# EAGLE design otto (EAGLE 9.6.2)
AUTHOR: w. boyett; CONTACT_COMPANY: github.com/watsonboyett; LICENSE: CC-BY-SA; REV: 2A
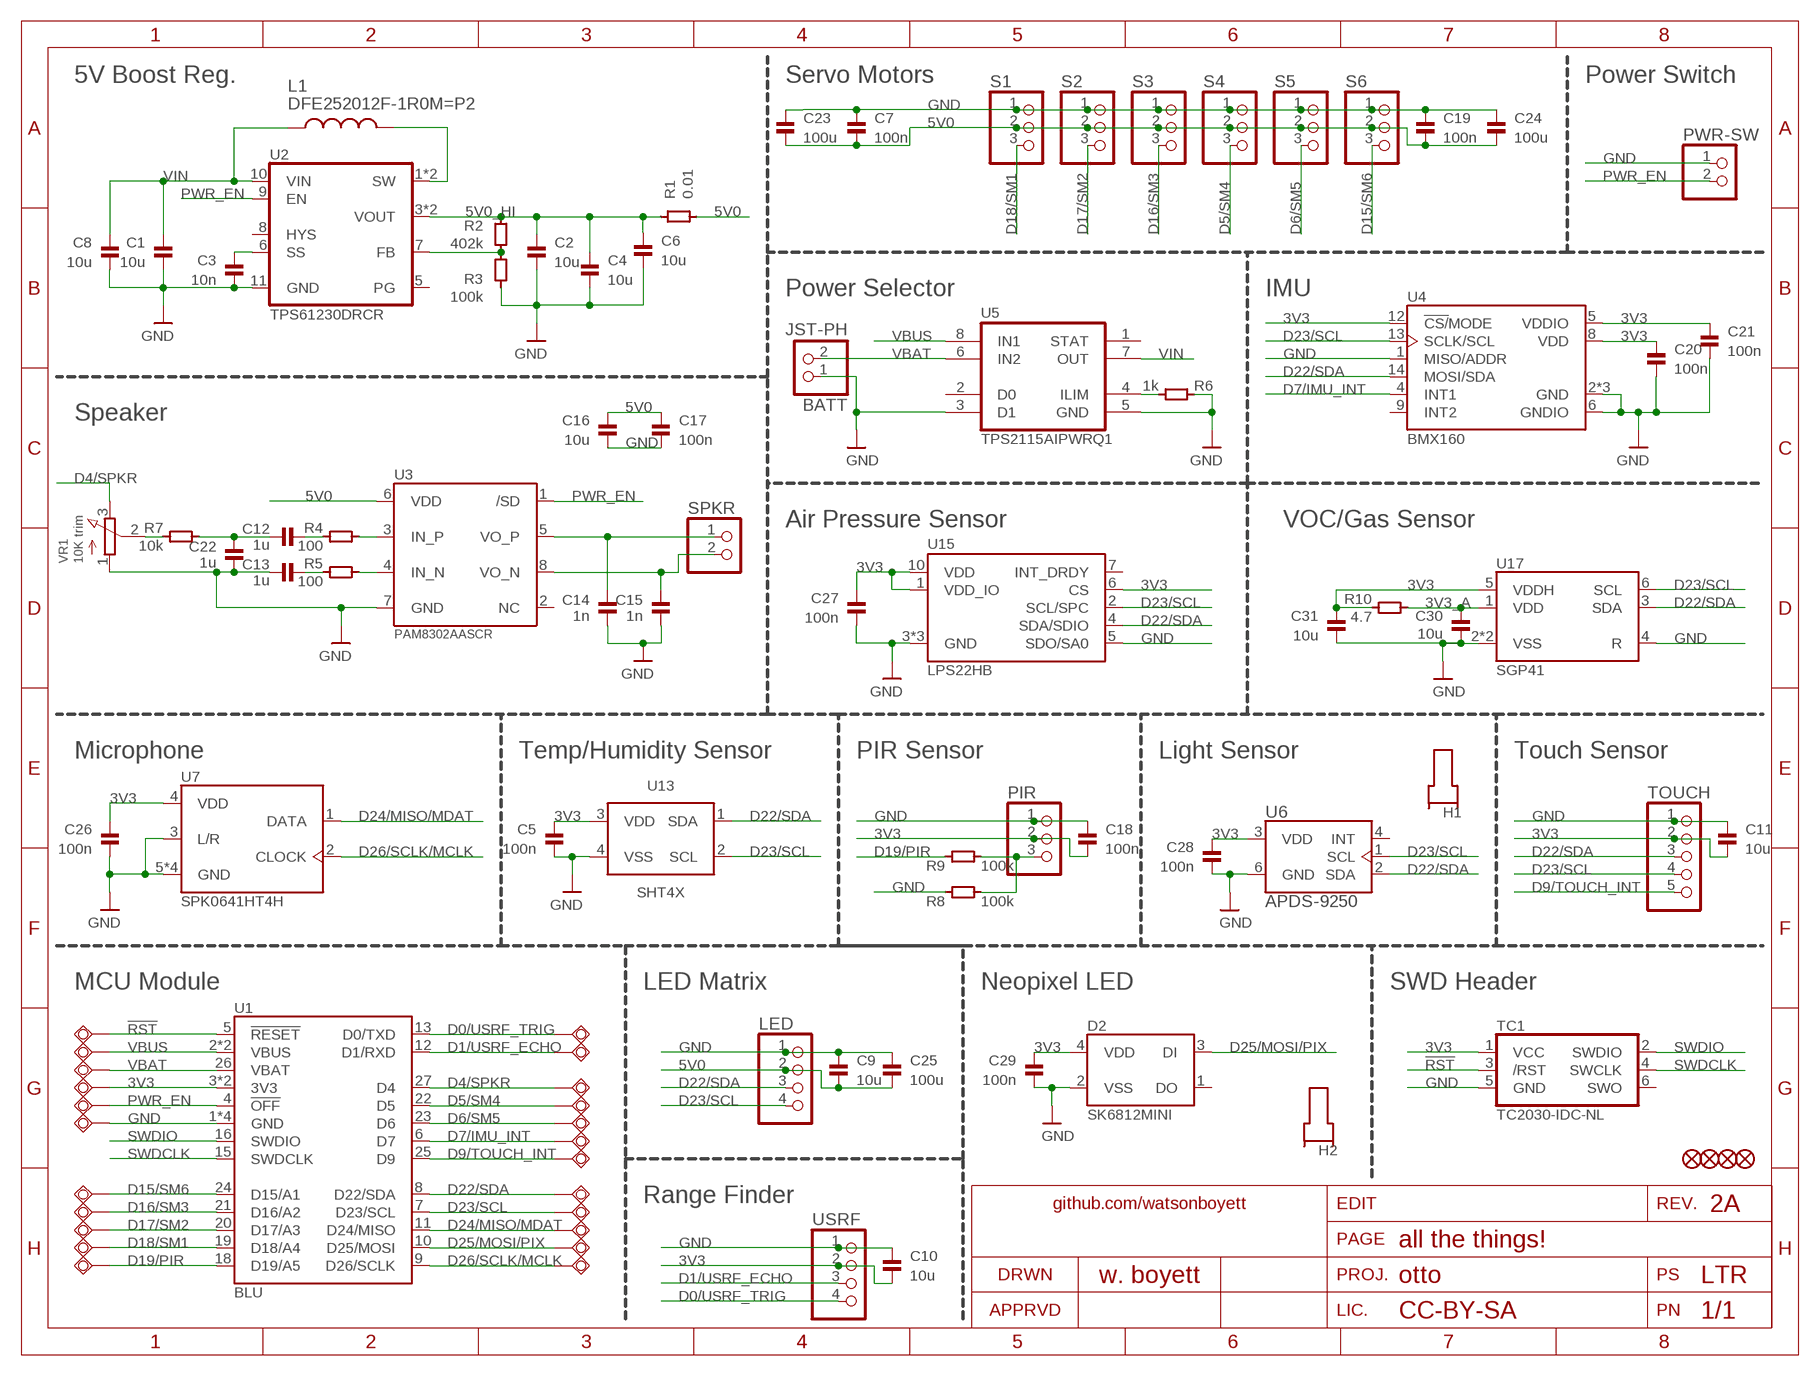
[diagram p0: schematic, sheet 1]
FRAME1 (LETTER_L): SECTION: all the things!

## Parts
3V3  TPSQTP10R  [TP10R]
BATT  JST-PH  CON_JST_PH_2PIN-S2B  [JSTPH2-S2B]
C1  10u  CAP_CERAMIC_0603  [_0603]
C2  10u  CAP_CERAMIC_0603  [_0603]
C3  10n  CAP_CERAMIC_0603  [_0603]
C4  10u  CAP_CERAMIC_0603  [_0603]
C5  100n  CAP_CERAMIC_0603  [_0603]
C6  10u  CAP_CERAMIC_0603  [_0603]
C7  100n  CAP_CERAMIC_0603  [_0603]
C8  10u  CAP_CERAMIC_0603  [_0603]
C9  10u  CAP_CERAMIC_0603  [_0603]
C10  10u  CAP_CERAMIC_0603  [_0603]
C11  10u  CAP_CERAMIC_0603  [_0603]
C12  1u  CAP_CERAMIC_0603  [_0603]
C13  1u  CAP_CERAMIC_0603  [_0603]
C14  1n  CAP_CERAMIC_0603  [_0603]
C15  1n  CAP_CERAMIC_0603  [_0603]
C16  10u  CAP_CERAMIC_0603  [_0603]
C17  100n  CAP_CERAMIC_0603  [_0603]
C18  100n  CAP_CERAMIC_0603  [_0603]
C19  100n  CAP_CERAMIC_0603  [_0603]
C20  100n  CAP_CERAMIC_0603  [_0603]
C21  100n  CAP_CERAMIC_0603  [_0603]
C22  1u  CAP_CERAMIC_0603  [_0603]
C23  100u  CAP_CERAMIC_1206  [_1206]
C24  100u  CAP_CERAMIC_1206  [_1206]
C25  100u  CAP_CERAMIC_1206  [_1206]
C26  100n  CAP_CERAMIC_0603  [_0603]
C27  100n  CAP_CERAMIC_0603  [_0603]
C28  100n  CAP_CERAMIC_0603  [_0603]
C29  100n  CAP_CERAMIC_0603  [_0603]
C30  10u  CAP_CERAMIC_0603  [_0603]
C31  10u  CAP_CERAMIC_0603  [_0603]
D0  TPSQTP10R  [TP10R]
D1  TPSQTP10R  [TP10R]
D2  SK6812MINI  [SK6812MINI]
D4  TPSQTP10R  [TP10R]
D5  TPSQTP10R  [TP10R]
D6  TPSQTP10R  [TP10R]
D7  TPSQTP10R  [TP10R]
D9  TPSQTP10R  [TP10R]
D15  TPSQTP10R  [TP10R]
D16  TPSQTP10R  [TP10R]
D17  TPSQTP10R  [TP10R]
D18  TPSQTP10R  [TP10R]
D19  TPSQTP10R  [TP10R]
D24  TPSQTP10R  [TP10R]
D25  TPSQTP10R  [TP10R]
D26  TPSQTP10R  [TP10R]
FID1  FIDUCIAL0.8MM  [FIDUCIAL_0.8MM]
FID2  FIDUCIAL0.8MM  [FIDUCIAL_0.8MM]
FID3  FIDUCIAL0.8MM  [FIDUCIAL_0.8MM]
FID5  FIDUCIAL0.8MM  [FIDUCIAL_0.8MM]
GND  TPSQTP10R  [TP10R]
H1  VLP-XXX-X  [VLP-XXX-X]
H2  VLP-XXX-X  [VLP-XXX-X]
L1  DFE252012F-1R0M=P2  [INDC2520X120N]
LED  PINHD-1X4  [1X04]
PEN  TPSQTP10R  [TP10R]
PIR  PINHD-1X3  [1X03]
PWR-SW  PINHD-1X2  [1X02]
R1  0.01  RESISTOR_0603  [_0603]
R2  402k  RESISTOR_0603  [_0603]
R3  100k  RESISTOR_0603  [_0603]
R4  100  RESISTOR_0603  [_0603]
R5  100  RESISTOR_0603  [_0603]
R6  1k  RESISTOR_0603  [_0603]
R7  10k  RESISTOR_0603  [_0603]
R8  100k  RESISTOR_0603  [_0603]
R9  100k  RESISTOR_0603  [_0603]
R10  4.7  RESISTOR_0603  [_0603]
RST  TPSQTP10R  [TP10R]
S1  PINHD-1X3  [1X03]
S2  PINHD-1X3  [1X03]
S3  PINHD-1X3  [1X03]
S4  PINHD-1X3  [1X03]
S5  PINHD-1X3  [1X03]
S6  PINHD-1X3  [1X03]
SCL  TPSQTP10R  [TP10R]
SDA  TPSQTP10R  [TP10R]
SPKR  PINHD-1X2  [1X02]
TC1  TC2030-IDC-NL  [TC2030-NL]
TOUCH  PINHD-1X5  [1X05]
U1  BLU  [BLU]
U2  TPS61230DRCR  [VREG_V62/16624-01YE]
U3  PAM8302AASCR  AUDIOAMP_PAM8302A  [MSOP8_0.65MM]
U4  BMX160  [PQFN50P250X300X100-14N]
U5  TPS2115AIPWRQ1  [SOP65P640X120-8N]
U6  APDS-9250  [SON65P200X200X75-6N]
U7  SPK0641HT4H  [SPK0641HT4H-1]
U13  SHT4X  [SHT4X-DFN4]
U15  LPS22HB  [HLGA-10L]
U17  SGP41  [SGP41]
USRF  PINHD-1X4  [1X04]
VBS  TPSQTP10R  [TP10R]
VBT  TPSQTP10R  [TP10R]
VR1  10K trim  TRIMPOT3303W/X  [TRIMPOT_BOURNS_3303W]

## Nets
3V3: 3V3.TP C5.1 C10.2 C11.2 C18.2 C20.1 C21.1 C26.1 C27.1 C28.1 C29.1 C31.1 D2.4(VDD) PIR.2 R10.1 TC1.1(VCC) TOUCH.2 U1.3(3V3) U1.28(3V3) U4.5(VDDIO) U4.8(VDD) U4.12(!CS/!MODE) U6.3(VDD) U7.4(VDD) U13.3(VDD) U15.1(VDD_IO) U15.6(CS) U15.10(VDD) U17.5(VDDH) USRF.2
3V3_A: C30.1 R10.2 U17.1(VDD)
5V0: C7.2 C9.2 C16.1 C17.1 C19.2 C23.2 C24.2 C25.2 LED.2 R1.1 S1.2 S2.2 S3.2 S4.2 S5.2 S6.2 U3.6(VDD)
5V0_HI: C2.1 C4.1 C6.1 R1.2 R2.1 U2.3(VOUT) U2.4(VOUT)
!RST: RST.TP TC1.3(/RST) U1.5(!RESET)
D0/USRF_TRIG: D0.TP U1.13(D0/TXD) USRF.4
D1/USRF_ECHO: D1.TP U1.12(D1/RXD) USRF.3
D4/SPKR: D4.TP U1.27(D4) VR1.3(E)
D5/SM4: D5.TP S4.3 U1.22(D5)
D6/SM5: D6.TP S5.3 U1.23(D6)
D7/IMU_INT: D7.TP U1.6(D7) U4.4(INT1)
D9/TOUCH_INT: D9.TP TOUCH.5 U1.25(D9)
D15/SM6: D15.TP S6.3 U1.24(D15/A1)
D16/SM3: D16.TP S3.3 U1.21(D16/A2)
D17/SM2: D17.TP S2.3 U1.20(D17/A3)
D18/SM1: D18.TP S1.3 U1.19(D18/A4)
D19/PIR: D19.TP R9.1 U1.18(D19/A5)
D22/SDA: LED.3 SDA.TP TOUCH.3 U1.8(D22/SDA) U4.14(MOSI/SDA) U6.2(SDA) U13.1(SDA) U15.4(SDA/SDIO) U17.3(SDA)
D23/SCL: LED.4 SCL.TP TOUCH.4 U1.7(D23/SCL) U4.13(SCLK/SCL) U6.1(SCL) U13.2(SCL) U15.2(SCL/SPC) U17.6(SCL)
D24/MISO/MDAT: D24.TP U1.11(D24/MISO) U7.1(DATA)
D25/MOSI/PIX: D2.3(DI) D25.TP U1.10(D25/MOSI)
D26/SCLK/MCLK: D26.TP U1.9(D26/SCLK) U7.2(CLOCK)
GND: BATT.1 C1.2 C2.2 C3.2 C4.2 C5.2 C6.2 C7.1 C8.2 C9.1 C10.1 C11.1 C13.1 C14.1 C15.1 C16.2 C17.2 C18.1 C19.1 C20.2 C21.2 C22.1 C23.1 C24.1 C25.1 C26.2 C27.2 C28.2 C29.2 C30.2 C31.2 D2.2(VSS) GND.TP LED.1 PIR.1 PWR-SW.1 R3.2 R6.1 R8.1 S1.1 S2.1 S3.1 S4.1 S5.1 S6.1 TC1.5(GND) TOUCH.1 U1.1(GND) U1.14(GND) U1.17(GND) U1.30(GND) U2.11(GND) U3.7(GND) U4.1(MISO/ADDR) U4.2(GND) U4.3(GND) U4.6(GNDIO) U4.7(GND) U5.3(D1) U5.5(GND) U6.6(GND) U7.3(L/R) U7.5(GND) U7.6(GND) U7.7(GND) U7.8(GND) U13.4(VSS) U15.3(GND) U15.5(SDO/SA0) U15.8(GND) U15.9(GND) U17.2(VSS) U17.4(R) U17.EP(VSS) USRF.1 VR1.1(A)
N$1: C3.1 U2.6(SS)
N$2: R2.2 R3.1 U2.7(FB)
N$3: R7.1 VR1.2(S)
N$4: C12.1 C22.2 R7.2
N$5: PIR.3 R8.2 R9.2
N$8: R6.2 U5.4(ILIM)
N$9: L1.2 U2.1(SW) U2.2(SW)
N$10: C12.2 R4.1
N$11: C13.2 R5.1
N$12: R4.2 U3.3(IN_P)
N$13: R5.2 U3.4(IN_N)
N$16: C14.2 SPKR.1 U3.5(VO_P)
N$17: C15.2 SPKR.2 U3.8(VO_N)
PWR_EN: PEN.TP PWR-SW.2 U1.4(!OFF) U2.9(EN) U3.1(/SD)
SWDCLK: TC1.4(SWCLK) U1.15(SWDCLK)
SWDIO: TC1.2(SWDIO) U1.16(SWDIO)
VBAT [power]: BATT.2 U1.26(VBAT) U5.6(IN2) VBT.TP
VBUS: U1.2(VBUS) U1.29(VBUS) U5.8(IN1) VBS.TP
VIN [power]: C1.1 C8.1 L1.1 U2.10(VIN) U5.7(OUT)
Unconnected: D2.1(DO) TC1.6(SWO) U2.5(PG) U2.8(HYS) U3.2(NC) U4.9(INT2) U5.1(STAT) U5.2(D0) U6.4(INT) U15.7(INT_DRDY)

## Notes on the sheet
- 5V Boost Reg. | Servo Motors | Power Switch
- Power Selector | IMU
- Speaker
- Air Pressure Sensor | VOC/Gas Sensor
- Microphone | Temp/Humidity Sensor | PIR Sensor | Light Sensor | Touch Sensor
- MCU Module | LED Matrix | Neopixel LED | SWD Header
- Range Finder

## Library data of the parts
3V3 D0 D1 D4-D7 D9 D15-D19 D24-D26 GND PEN RST SCL SDA VBS VBT = otto:TPSQ: Test pad
BATT = otto:CON_JST_PH_2PIN: JST 2-Pin Right-Angle Connector PH-Series - 4UConnector: 17311 SH-Series - 4UConnector: 07278; DESCRIPTION: CONN HEADER SMD R/A 2POS 2MM; MFG: JST; MPN: S2B-PH-SM4-TB(LF)(SN); PN-DGKY: 455-1749-1-ND; PN-DK: 455-1749-1-ND
C1-C31 = otto:CAP_CERAMIC: Ceramic Capacitors For new designs, use the packages preceded by an '_' character since they are more reliable: The following footprints should be used on most boards: _0402 - Standard footprint for regular board layouts _0603 - Standard footprint for regular board layouts _0805 - Standard footprint for regular board layouts _1206 - Standard footprint for regular board layouts For extremely tight-pitch boards where space is at a premium, the following 'micro-pitch' footprints can be used (smaller pads, no silkscreen outline, etc.): _0402MP - Micro-pitch footprint for very dense/compact boards _0603MP - Micro-pitch footprint for very dense/compact boards _0805MP - Micro-pitch footprint for very dense/compact boards _1206MP - Micro-pitch footprint for very dense/compact boards; DESCRIPTION: CAP CER 10UF 25V X5R 0805; MFG: Samsung Electro-Mechanics; MPN: CL21A106KAYNNNE; PN-DGKY: 445-11462-1-ND; PN-DK: 1276-2891-1-ND
D2 = otto:SK6812MINI: NeoPixel Mini 3535 RGB LEDs w/ Integrated Driver Chip - White; DESCRIPTION: NeoPixel Mini 3535 RGB LEDs w/ Integrated Driver Chip - White; DIGI-KEY_PART_NUMBER: 1528-1542-ND; DIGI-KEY_PURCHASE_URL: https://www.digikey.com/product-detail/en/adafruit-industries-llc/2659/1528-1542-ND/5804108?utm_source=snapeda&utm_medium=aggregator&utm_campaign=symbol; MF: Adafruit Industries; MP: 2659; PACKAGE: TQFP-32 Adafruit Industries
FID1-FID3 FID5 = otto:FIDUCIAL: Fiducial Alignment Points Various fiducial points for machine vision alignment.
H1 H2 = otto:VLP-XXX-X
L1 = otto:DFE252012F-1R0M=P2: Inductor Power Chip Shielded Multi-Layer 1uH 20% 1MHz Metal 3.3A 40mOhm DCR 1008 T/R; DESCRIPTION: Inductor with Inductance: 1uH Tol. +/-20%, Package: 1008 (2520); DIGI-KEY_PART_NUMBER: 490-13053-1-ND; MF: Murata Electronics; MP: DFE252012F-1R0M=P2; PACKAGE: 2520 Murata; PURCHASE-URL: https://pricing.snapeda.com/search/part/DFE252012F-1R0M=P2/?ref=eda
LED USRF = otto:PINHD-1X4: PIN HEADER
PIR S1-S6 = otto:PINHD-1X3: PIN HEADER
PWR-SW SPKR = otto:PINHD-1X2: PIN HEADER
R1-R10 = otto:RESISTOR: Resistors For new designs, use the packages preceded by an '_' character since they are more reliable: The following footprints should be used on most boards: _0402 - Standard footprint for regular board layouts _0603 - Standard footprint for regular board layouts _0805 - Standard footprint for regular board layouts _1206 - Standard footprint for regular board layouts For extremely tight-pitch boards where space is at a premium, the following 'micro-pitch' footprints can be used (smaller pads, no silkscreen outline, etc.): _0402MP - Micro-pitch footprint for very dense/compact boards _0603MP - Micro-pitch footprint for very dense/compact boards _0805MP - Micro-pitch footprint for very dense/compact boards _1206MP - Micro-pitch footprint for very dense/compact boards
TC1 = otto:TC2030-IDC: Tag-Connect In Circuit Programming & Debug Cable 6 Pin http://www.tag-connect.com; DESCRIPTION: Cable Adapter 6 Pos; MFG: Tag-Connect; MPN: TC2030-IDC
TOUCH = otto:PINHD-1X5: PIN HEADER
U1 = otto:BLU
U2 = otto:TPS61230DRCR; DESCRIPTION: High Efficiency Synchronous Boost Converter With 5-A Switch 10-VSON -40 to 85; DIGI-KEY_PART_NUMBER: 296-37761-1-ND; MF: Texas Instruments; MP: TPS61230DRCR; PACKAGE: VSON-10 Texas Instruments; PURCHASE-URL: https://pricing.snapeda.com/search/part/TPS61230DRCR/?ref=eda
U3 = otto:AUDIOAMP_PAM8302A: PAM8302A - 2.5W Class-D Mono Audio Amplifier MSOP8 = PAM8302AASCR
U4 = otto:BMX160: IMU ACCEL/GYRO/MAG; AVAILABILITY: Unavailable; DESCRIPTION: IMU ACCEL/GYRO/MAG; MF: Bosch Sensortec; MP: BMX160; PACKAGE: VFLGA-14 Bosch Sensortec; PRICE: None
U5 = otto:TPS2115AIPWRQ1: AUTO-SWITCHING POWER MULTIPLEXER; AVAILABILITY: Good; DESCRIPTION: Pwr Mux Autoswitch 1.5V to 5.5V 1.25A Automotive 8-Pin TSSOP T/R; MF: Texas Instruments; MP: TPS2115AIPWRQ1; PACKAGE: TSSOP-8 Texas Instruments; PRICE: 1.69 USD
U6 = otto:APDS-9250: Digital RGB, IR and Ambient Light Sensor with I2C Output; DESCRIPTION: Optical Sensor Ambient 550nm I²C 6-SMD Module; DIGI-KEY_PART_NUMBER: 516-3293-1-ND; MF: Broadcom Limited; MP: APDS-9250; PACKAGE: - Avago; PURCHASE-URL: https://pricing.snapeda.com/search/part/APDS-9250/?ref=eda
U7 = otto:SPK0641HT4H; MFG: Knowles; MPN: SPK0641HT4H-1; PN-DK: 423-1425-1-ND
U13 = otto:SHT4X: SENSOR Humidity/Temperature 3V I2C 2%; MFG: Sensirion AG; MPN: SHT21; PN-DK: 1649-1005-1-ND
U15 = otto:LPS22HB: Pressure Sensor 3.77 PSI ~ 18.27 PSI (26 kPa ~ 126 kPa) Absolute 24 bit; MFG: STMicroelectronics; MPN: LPS22HBTR; PN-DK: 497-16265-1-ND
U17 = otto:SGP41: Sensirion SGP30 multi-pixel gas sensor
VR1 = otto:TRIMPOT: 3-Pin SMT Trimpots Bourns TC33 (X-2) Series 1K - Digikey: TC33X-102ECT-ND 10K - Digikey: TC33X-2-103E 100K - Digikey: TC33X-104ECT-ND Bourns 3303 (W) Series 3mm 10K Single Turn - Digikey: 3303W-103ETR-ND 3mm 100K Single Turn - Digikey: 3303X-104ETR-ND

## Net classes
1 power: width 0.254 mm

## Board
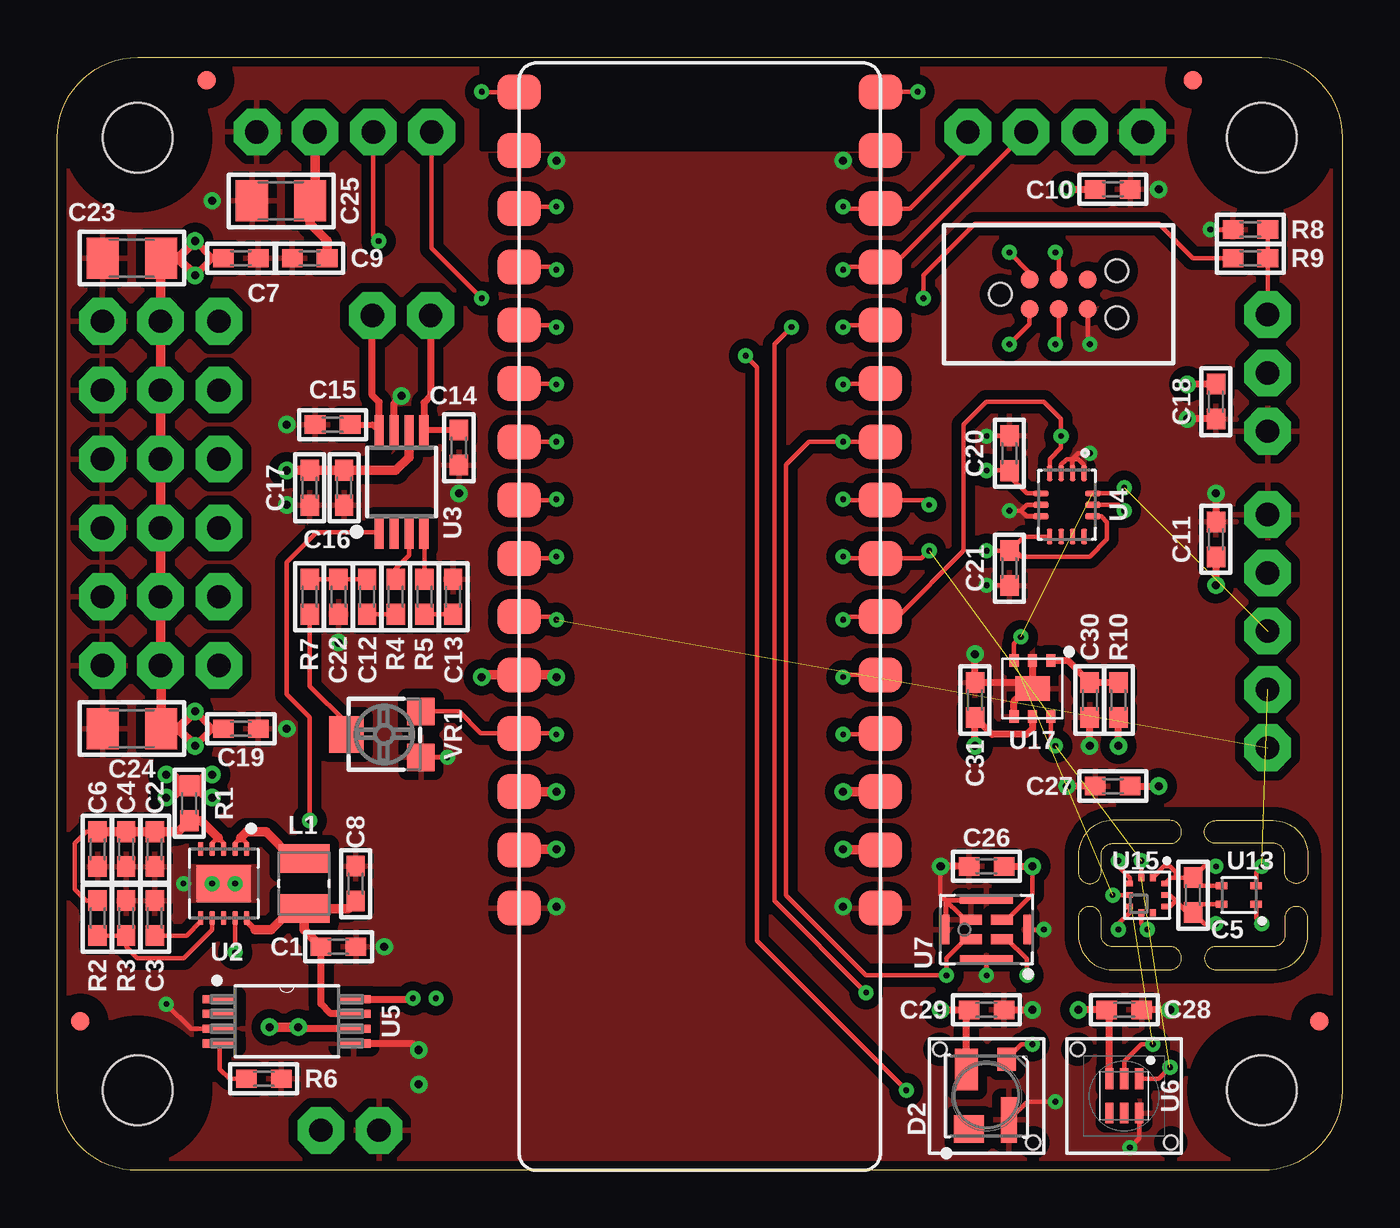
[diagram p1: board, top side]
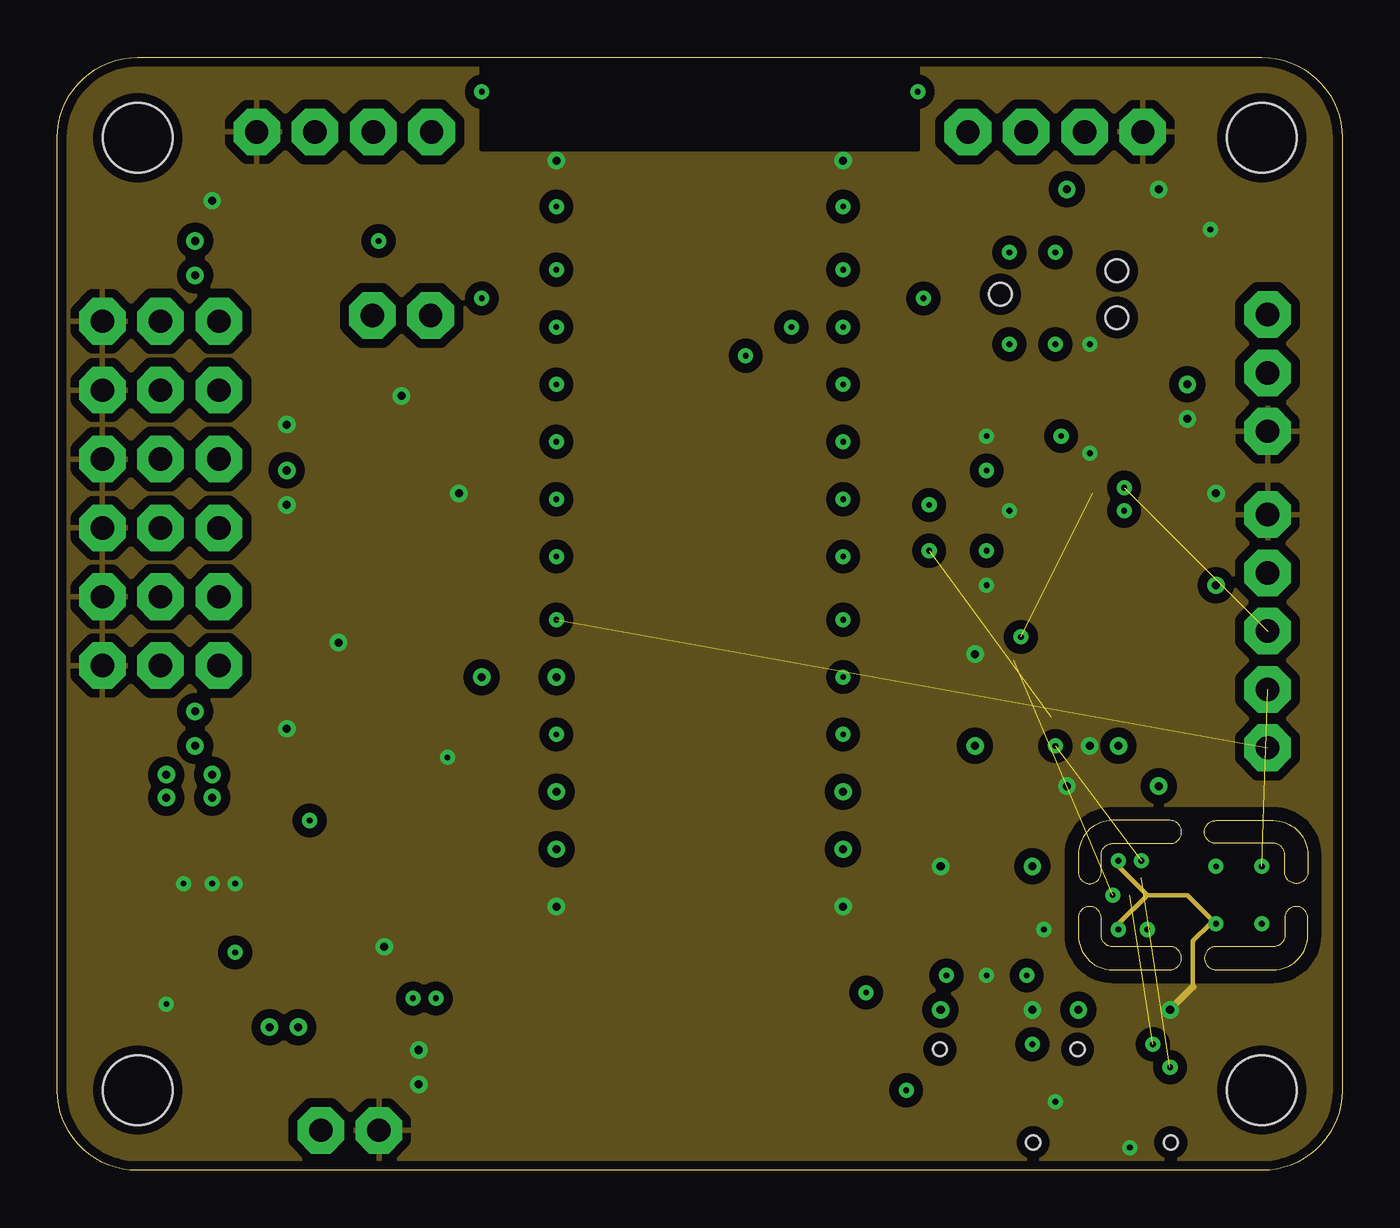
[diagram p2: board, inner layer GND]
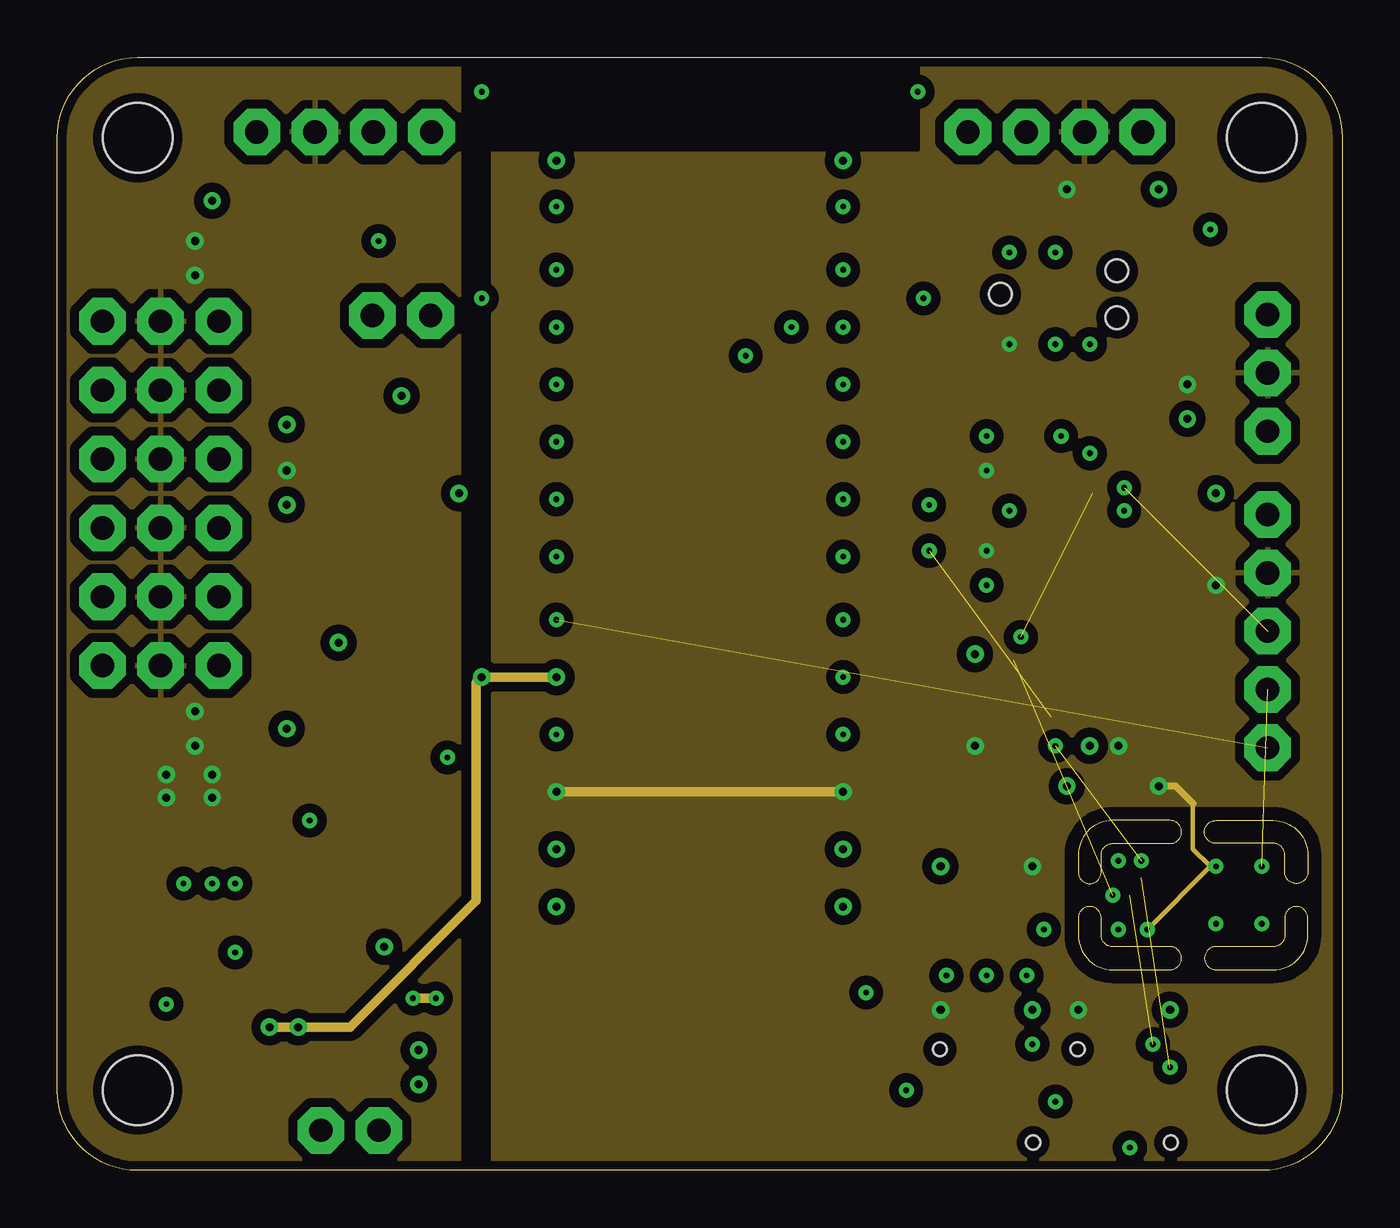
[diagram p3: board, inner layer PWR]
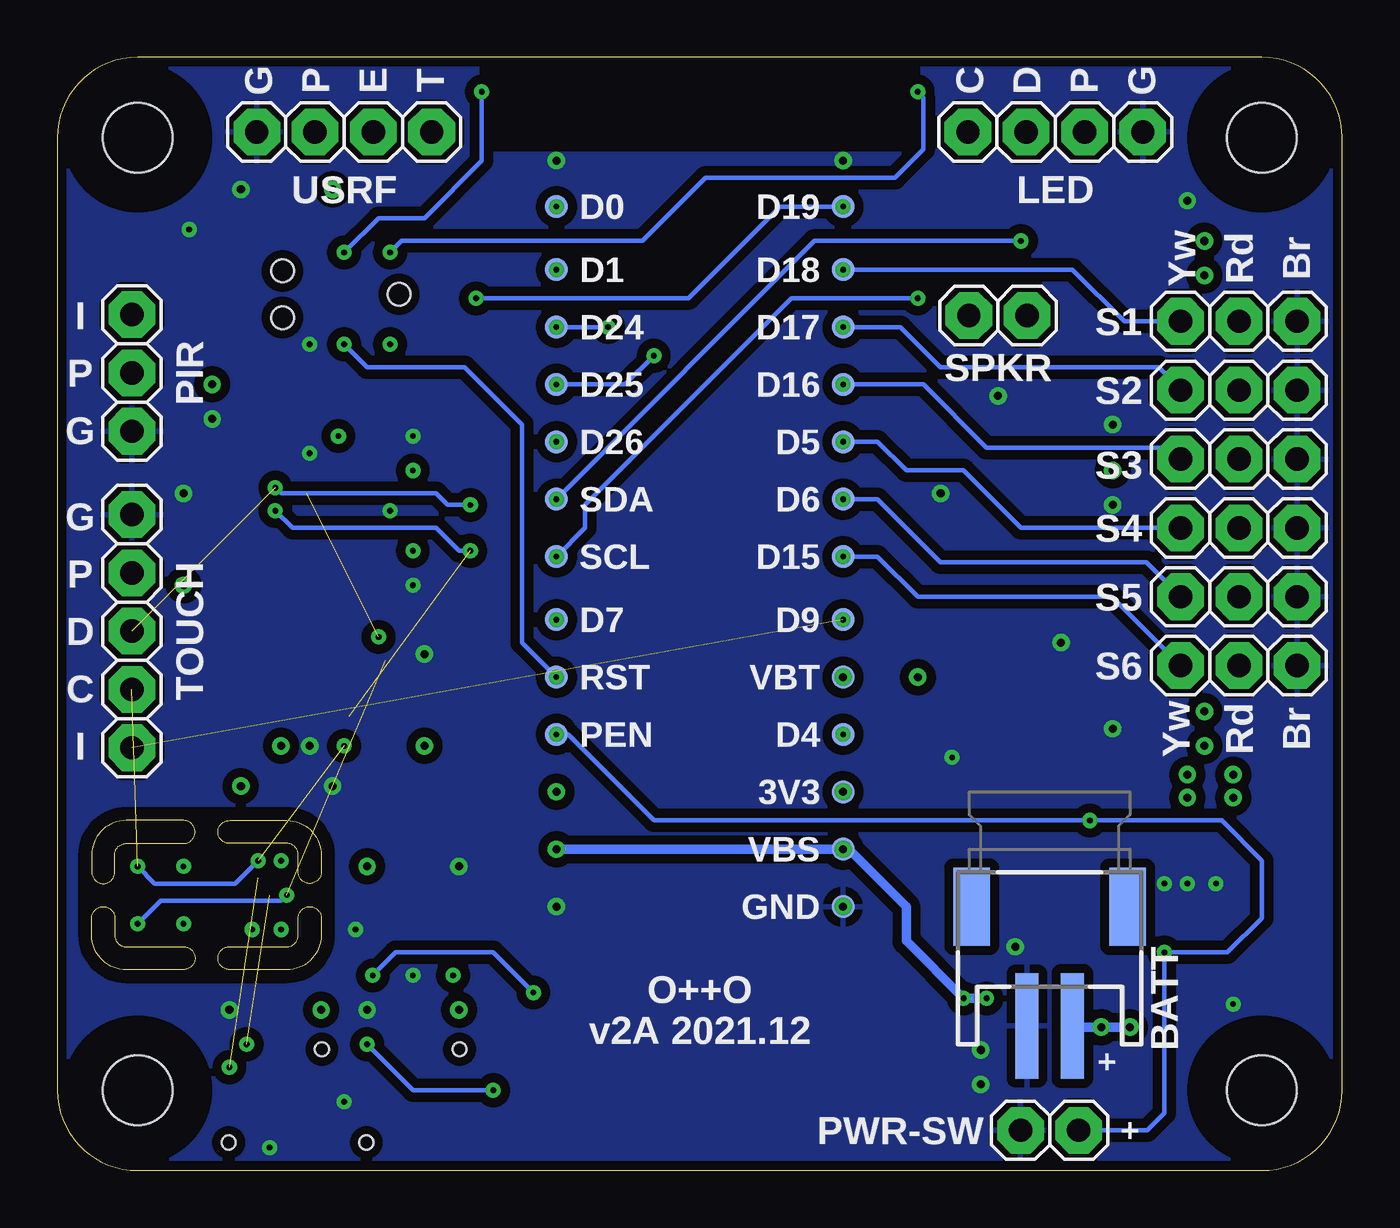
[diagram p4: board, bottom side, seen from below]

Size 56 x 48.5 mm. Coordinates in mm from the lower left corner, seen from the top.
Outline: 0,3.5 0,45 arc-90 3.5,48.5 52.5,48.5 arc-90 56,45 56,3.5 arc-90 52.5,0 3.5,0 arc-90 0,3.5
Outline: 44.5,11 44.5,10.25 arc90 46,8.75 48.5,8.75 arc90 49,9.25 arc90 48.5,9.75 46,9.75 arc-90 45.5,10.25 45.5,11 arc90 45,11.5 arc90 44.5,11
Outline: 53,9.75 50.5,9.75 arc90 50,9.25 arc90 50.5,8.75 53,8.75 arc90 54.5,10.25 54.5,11 arc90 54,11.5 arc90 53.5,11 53.5,10.25 arc-90 53,9.75
Outline: 50,14.75 arc-90 50.5,15.25 53,15.25 arc-90 54.5,13.75 54.5,13 arc-90 54,12.5 arc-90 53.5,13 53.5,13.75 arc90 53,14.25 50.5,14.25 arc-90 50,14.75
Outline: 45,12.5 arc90 45.5,13 45.5,13.75 arc-90 46,14.25 48.5,14.25 arc90 49,14.75 arc90 48.5,15.25 46,15.25 arc90 44.5,13.75 44.5,13 arc90 45,12.5
Copper layers (1+2*15+16): Top 0.035mm / dielectric 0.175mm / GND 0.035mm / dielectric 0.53mm / PWR 0.035mm / dielectric 0.175mm / Bottom 0.035mm
Design rules "pcbway-4layer-10mm *": minimum track width 8mil, minimum drill 0.25mm, track to track 8mil, track to pad 8mil, pad to pad 8mil, via to via 8mil, smd to smd 8mil, copper to edge 12mil, drill to drill 6mil, minimum pad ring 10mil, minimum via ring 8mil, stop-mask expansion 4mil, vias tented up to drill 20mil, thermal gap 15mil

### Footprints (pad centres in the part's own frame; a part is rotated, then mirrored left to right if it is on the bottom)
TP10R = smd 1 x 1: TP 0,0
JSTPH2-S2B = smd 1 x 4.6: 1 -1,-3.7; 2 1,-3.7 | smd 1.6 x 3.4: NC1 -3.4,1.5; NC2 3.4,1.5
_0603 = smd 0.9 x 0.8: 1 -0.762,0; 2 0.762,0
_1206 = smd 1.4 x 1.8: 1 -1.27,0; 2 1.27,0
SK6812MINI = smd 1.2 x 1.3: 1 -1.45,0.775 | smd 2 x 0.7: 2 -1.05,-0.975 | smd 1 x 0.8: 3 1.6,-0.875 | smd 1.8 x 1: 4 1.15,0.875
FIDUCIAL_0.8MM = smd 0.8 x 0.8: 1 0,0
VLP-XXX-X = hole 0.61: 2.032,2.032; -2.032,-2.032
INDC2520X120N = smd 1.24 x 2.22: 1 -1.09,0; 2 1.09,0
1X04 = drill 1.016 pad 2.032 octagon: 1 -3.81,0; 2 -1.27,0; 3 1.27,0; 4 3.81,0
1X03 = drill 1.016 pad 2.032 octagon: 1 -2.54,0; 2 0,0; 3 2.54,0
1X02 = drill 1.016 pad 2.032 octagon: 1 -1.27,0; 2 1.27,0
TC2030-NL = smd 0.787 x 0.787: 1 -1.27,-0.635; 2 -1.27,0.635; 3 0,-0.635; 4 0,0.635; 5 1.27,-0.635; 6 1.27,0.635 | hole 0.991: -2.54,0; 2.54,1.016; 2.54,-1.016
1X05 = drill 1.016 pad 2.032 octagon: 1 -5.08,0; 2 -2.54,0; 3 0,0; 4 2.54,0; 5 5.08,0
BLU = smd 1.905 x 1.524: 1 -7.874,-11.43; 2 -7.874,-13.97; 3 -7.874,-16.51; 4 -7.874,-19.05; 5 -7.874,-21.59; 6 -7.874,-24.13; 7 -7.874,-26.67; 8 -7.874,-29.21; 9 -7.874,-31.75; 10 -7.874,-34.29; 11 -7.874,-36.83; 12 -7.874,-39.37; 13 -7.874,-41.91; 14 -7.874,-44.45; 15 -7.874,-46.99; 16 7.874,-46.99; 17 7.874,-44.45; 18 7.874,-41.91; 19 7.874,-39.37; 20 7.874,-36.83; 21 7.874,-34.29; 22 7.874,-31.75; 23 7.874,-29.21; 24 7.874,-26.67; 25 7.874,-24.13; 26 7.874,-21.59; 27 7.874,-19.05; 28 7.874,-16.51; 29 7.874,-13.97; 30 7.874,-11.43
VREG_V62/16624-01YE = smd 0.6 x 0.24: 1 -1.5,1; 2 -1.5,0.5; 3 -1.5,0; 4 -1.5,-0.5; 5 -1.5,-1; 6 1.5,-1; 7 1.5,-0.5; 8 1.5,0; 9 1.5,0.5; 10 1.5,1 | smd 1.6 x 2.4: 11 0,0
MSOP8_0.65MM = smd 0.4 x 1.4: 1 -0.975,-2.2; 2 -0.325,-2.2; 3 0.325,-2.2; 4 0.975,-2.2; 5 0.975,2.2; 6 0.325,2.2; 7 -0.325,2.2; 8 -0.975,2.2
PQFN50P250X300X100-14N = smd 0.68 x 0.25: 1 -1.38,0.75; 2 -1.38,0.25; 3 -1.38,-0.25; 4 -1.38,-0.75; 8 1.38,-0.75; 9 1.38,-0.25; 10 1.38,0.25; 11 1.38,0.75 | smd 0.25 x 0.68: 5 -0.5,-1.13; 6 0,-1.13; 7 0.5,-1.13; 12 0.5,1.13; 13 0,1.13; 14 -0.5,1.13
SOP65P640X120-8N = smd 1.473 x 0.356: 1 -2.921,0.965; 2 -2.921,0.33; 3 -2.921,-0.33; 4 -2.921,-0.965; 5 2.921,-0.965; 6 2.921,-0.33; 7 2.921,0.33; 8 2.921,0.965
SON65P200X200X75-6N = smd 0.9 x 0.4: 1 -0.75,0.65; 2 -0.75,0; 3 -0.75,-0.65; 4 0.75,-0.65; 5 0.75,0; 6 0.75,0.65
SPK0641HT4H-1 = smd 0.45 x 0.95: 1 -0.425,-0.675; 2 -0.425,0.675; 3 0.425,0.675; 4 0.425,-0.675 | smd 1.3 x 0.325: 5 0,-1.775; 7 0,1.775 | smd 0.325 x 2.3: 6 -1.275,0; 8 1.275,0
SHT4X-DFN4 = smd 0.5 x 0.3: 1 -0.75,0.4; 2 -0.75,-0.4; 3 0.75,-0.4; 4 0.75,0.4
HLGA-10L = smd 0.3 x 0.25: 1 -0.762,0.25; 2 -0.762,-0.25; 6 0.762,-0.25; 7 0.762,0.25 | smd 0.25 x 0.3: 3 -0.5,-0.762; 4 0,-0.762; 5 0.5,-0.762; 8 0.5,0.762; 9 0,0.762; 10 -0.5,0.762
SGP41 = smd 0.55 x 0.4: 1 -1.225,0.8; 2 -1.225,0; 3 -1.225,-0.8; 4 1.225,-0.8; 5 1.225,0; 6 1.225,0.8 | smd 1.05 x 1.5: EP 0,0
HOLE_4-40_NORM_BUTTON = hole 3.048: 0,0
TRIMPOT_BOURNS_3303W = smd 1.2 x 1.2: 1 -1,-1.6; 3 1,-1.6 | smd 1.6 x 1.5: 2 0,1.65

### Placement (x,y rotation side)
3V3  21.75,16.5 0 bottom
BATT  12.75,10 0 bottom
C1  12.25,9.75 0 top
C2  4.25,14 270 top
C3  4.25,11 90 top
C4  3,14 270 top
C5  49.5,12 270 top
C6  1.75,14 270 top
C7  8,39.75 180 top
C8  13,12.5 90 top
C9  11,39.75 0 top
C10  46,42.75 180 top
C11  50.5,27.5 270 top
C12  13.5,25 270 top
C13  17.25,25 270 top
C14  17.5,31.5 90 top
C15  12,32.5 0 top
C16  12.5,29.75 270 top
C17  11,29.75 270 top
C18  50.5,33.5 90 top
C19  8,19.25 180 top
C20  41.5,31.25 90 top
C21  41.5,26.25 270 top
C22  12.25,25 90 top
C23  3.25,39.75 0 top
C24  3.25,19.25 0 top
C25  9.75,42.25 0 top
C26  40.5,13.25 180 top
C27  46,16.75 180 top
C28  46.5,7 0 top
C29  40.5,7 0 top
C30  45,20.5 270 top
C31  40,20.5 90 top
D0  34.25,42 0 bottom
D1  34.25,39.25 0 bottom
D2  40.5,3.25 90 top
D4  21.75,19 0 bottom
D5  21.75,31.75 0 bottom
D6  21.75,29.25 0 bottom
D7  34.25,24 0 bottom
D9  21.75,24 0 bottom
D15  21.75,26.75 0 bottom
D16  21.75,34.25 0 bottom
D17  21.75,36.75 0 bottom
D18  21.75,39.25 0 bottom
D19  21.75,42 0 bottom
D24  34.25,36.75 0 bottom
D25  34.25,34.25 0 bottom
D26  34.25,31.75 0 bottom
FID1  1,6.5 90 top
FID2  49.5,47.5 0 top
FID3  6.5,47.5 90 top
FID5  55,6.5 90 top
GND  21.75,11.5 0 bottom
H1  46.5,3.25 270 top
H2  40.5,3.25 270 top
L1  10.75,12.5 90 top
LED  12.5,45.25 180 bottom
PEN  34.25,19 0 bottom
PIR  52.75,34.75 90 bottom
PWR-SW  12.75,1.75 0 bottom
R1  5.75,16 270 top
R2  1.75,11 270 top
R3  3,11 90 top
R4  14.75,25 90 top
R5  16,25 90 top
R6  9,4 180 top
R7  11,25 90 top
R8  52,41 0 top
R9  52,39.75 0 top
R10  46.25,20.5 90 top
RST  34.25,21.5 0 bottom
S1  4.5,37 180 bottom
S2  4.5,34 180 bottom
S3  4.5,31 180 bottom
S4  4.5,28 180 bottom
S5  4.5,25 180 bottom
S6  4.5,22 180 bottom
SCL  34.25,26.75 0 bottom
SDA  34.25,29.25 0 bottom
SPKR  15,37.25 0 bottom
TC1  43.65,38.18 0 top
TOUCH  52.75,23.5 270 bottom
U1  28,0 180 top
U2  7.25,12.5 270 top
U3  15,30 0 top
U4  44,29 270 top
U5  10,6.5 0 top
U6  46.5,3.25 270 top
U7  40.5,10.5 90 top
U13  51.5,12 180 top
U15  47.5,12 270 top
U17  42.5,21 270 top
U$5  [HOLE_4-40_NORM_BUTTON]  3.5,45 0 top
U$6  [HOLE_4-40_NORM_BUTTON]  3.5,3.5 0 top
U$7  [HOLE_4-40_NORM_BUTTON]  52.5,3.5 0 top
U$8  [HOLE_4-40_NORM_BUTTON]  52.5,45 0 top
USRF  43.5,45.25 0 bottom
VBS  21.75,14 0 bottom
VBT  21.75,21.5 0 bottom
VR1  14.25,19 90 top

### Tracks (layer width: path | path; a pad name or v marks a point on that pad's centre or on a via)
3V3  (via drill 0.25, 0.35)
  Top 0.203: TC1.1 42.38,36.88 v41.5,36 | U4.5 42.25,29.5 41.5,30.25 C20.1 41.49,30.5 v40.5,30.5 | C21.1 41.51,27.01 42.12,27.62 U4.8 | C21.1 41.75,27.01 42.01,26.75 45,26.75 45.75,27.5 45.75,28.25 45.5,28.5 U4.12 | U7.4 41.31,11.06 41.53,11.06 42.5,12.03 v42.5,13.25 | U13.3 49.86,12.4 C5.1 | C5.1 49.99,13.25 v50.5,13.25 | 45.75,7.01 C28.1 | U15.10 48.52,12.76 48.75,12.76 | 48.75,12.76 C5.1 | U15.1 48.24,13.25 48.5,13.25 48.75,13 48.75,12.76 | U15.6 47.25,10.75 v47.5,10.5 | v40.5,27 40.51,27.01 C21.1
  Top 0.305: v44,42.75 C10.2 | C26.1 v42.5,13.25 | v49.25,34.25 50.49,34.25 C18.2 | C11.2 v50.5,25.5 | v44.5,7 C28.1 45.85,6.89 U6.3 | v38.5,7 C29.1 39.62,6.89 D2.4 | C27.1 v48,16.75 | v40,18.5 C31.1 40.74,19 42.25,19 42.5,19.25 U17.5 | v46.25,18.5 R10.1
  Top 0.406: U1.28 3V3.TP | U1.3 v34.25,16.5
  PWR 0.203: 50.25,13.25 v50.5,13.25 50.25,13.25 | 50.25,13.25 49.5,14 49.5,16 | 50.25,13.25 v47.5,10.5
  PWR 0.305: 49.5,16 48.75,16.75 v48,16.75
  PWR 0.406: 3V3.TP v34.25,16.5
  other vias: 21.75,16.5
  pour PWR (isolate 0.406): 19,-0.5 19,49 56.5,49 56.5,-0.5
3V3_A
  Top 0.305: R10.2 C30.1 44.04,22.23 U17.1
5V0  (via drill 0.35)
  Top 0.305: 6.75,19.25 v6,20 | C19.2 6.75,19.25 | 6.75,19.25 v6,18.5 | 6.75,39.75 v6,40.5 | C7.2 6.75,39.75 | 6.75,39.75 v6,39
  Top 0.406: 5.5,16.76 5.01,17.25 v4.75,17.25 | 6,16.76 6.49,17.25 v6.75,17.25 | U3.6 15.32,31.07 14.75,30.5 12.51,30.5 C16.1 C17.1 10.99,30.5 v10,30.5 | v4.75,16.25 4.99,16.25 5.5,16.76 | 5.5,16.76 R1.1 6,16.76 | v6.75,16.25 6.51,16.25 6,16.76 | 5.25,39.75 v6,40.5 | 5.25,39.75 C23.2 4.5,39.73 S1.2 S2.2 S3.2 S4.2 S5.2 S6.2 4.52,21.98 C24.2 5.25,19.25 | v6,39 5.25,39.75 | 5.25,19.25 v6,18.5 | 5.25,19.25 v6,20 | LED.2 11.23,42.46 C25.2 11.02,41.25 11.76,40.51 C9.2
  pour PWR (isolate 0.406): -0.5,-0.5 -0.5,49 17.5,49 17.5,-0.5
5V0_HI
  Top 0.203: U2.4 6.75,14.25 7,14.5 7.25,14.25 U2.3 | C6.1 1.25,14.76 0.75,14.26 0.75,12.26 1.25,11.76 R2.1
  Top 0.406: 7,14.5 6.26,15.24 R1.2 5.27,14.76 C2.1 C4.1 C6.1
!RST  (via drill 0.25)
  Top 0.203: TC1.3 43.65,36.15 v43.5,36 | U1.5 34.34,21.59 RST.TP
  Bottom 0.203: v43.5,36 42.5,35 38.25,35 35.75,32.5 35.75,23 RST.TP
  other vias: 34.25,21.5
CUT
  cutout Top: 37.5,44.5 18.5,44.5 18.5,50 37.5,50
  cutout GND: 37.5,44.5 18.5,44.5 18.5,50 37.5,50
  cutout PWR: 37.5,44.5 18.5,44.5 18.5,50 37.5,50
  cutout Bottom: 37.5,44.5 18.5,44.5 18.5,50 37.5,50
  cutout Top: 45.25,27.5 45.25,30.5 42.75,30.5 42.75,27.5
  cutout Top: 55,13.75 55,10.25 arc-90 53,8.25 46,8.25 arc-90 44,10.25 44,13.75 arc-90 46,15.75 53,15.75 arc-90
  cutout GND: 55,13.75 55,10.25 arc-90 53,8.25 46,8.25 arc-90 44,10.25 44,13.75 arc-90 46,15.75 53,15.75 arc-90
  cutout PWR: 55,13.75 55,10.25 arc-90 53,8.25 46,8.25 arc-90 44,10.25 44,13.75 arc-90 46,15.75 53,15.75 arc-90
  cutout Bottom: 55,13.75 55,10.25 arc-90 53,8.25 46,8.25 arc-90 44,10.25 44,13.75 arc-90 46,15.75 53,15.75 arc-90
D0/USRF_TRIG  (via drill 0.25)
  Top 0.203: D0.TP 34.34,41.91 U1.13 37.16,41.91 39.69,44.44 USRF.4
  other vias: 34.25,42
D1/USRF_ECHO  (via drill 0.25)
  Top 0.203: D1.TP 34.37,39.37 U1.12 36.37,39.37 USRF.3
  other vias: 34.25,39.25
D4/SPKR  (via drill 0.25)
  Top 0.203: VR1.3 17.5,20 18.45,19.05 U1.27 21.7,19.05 D4.TP
  other vias: 21.75,19
D5/SM4  (via drill 0.25)
  Top 0.203: U1.22 D5.TP
  Bottom 0.203: S4.3 14,28 16.5,30.5 19,30.5 20.25,31.75 D5.TP
  other vias: 21.75,31.75
D6/SM5  (via drill 0.25)
  Top 0.203: U1.23 21.71,29.21 D6.TP
  Bottom 0.203: S5.3 8.54,26.5 17.5,26.5 20.25,29.25 D6.TP
  other vias: 21.75,29.25
D7/IMU_INT  (via drill 0.25)
  Top 0.203: D7.TP 34.38,24.13 U1.6 36.63,24.13 39.5,27 39.5,32.5 40.5,33.5 43,33.5 43.75,32.75 v43.75,32 43.75,31.5 43.25,31 U4.4
  other vias: 34.25,24
D9/TOUCH_INT  (via drill 0.25)  (1 unrouted)
  Top 0.203: U1.25 21.62,24.13 D9.TP
  other vias: 21.75,24
D15/SM6  (via drill 0.25)
  Top 0.203: U1.24 21.67,26.67 D15.TP
  Bottom 0.203: S6.3 10.04,25 18.5,25 20.25,26.75 D15.TP
  other vias: 21.75,26.75
D16/SM3  (via drill 0.25)
  Top 0.203: U1.21 21.71,34.29 D16.TP
  Bottom 0.203: S3.3 7.54,31.5 15.5,31.5 18.25,34.25 D16.TP
  other vias: 21.75,34.25
D17/SM2  (via drill 0.25)
  Top 0.203: U1.20 21.67,36.83 D17.TP
  Bottom 0.203: D17.TP 19.25,36.75 17.5,35 8,35 7.04,34.04 S2.3
  other vias: 21.75,36.75
D18/SM1  (via drill 0.25)
  Top 0.203: U1.19 21.63,39.37 D18.TP
  Bottom 0.203: D18.TP 11.75,39.25 9.5,37 S1.3
  other vias: 21.75,39.25
D19/PIR  (via drill 0.25)
  Top 0.203: U1.18 20.22,42 D19.TP | v37.75,38 37.75,39 40,41.25 48,41.25 49.5,39.75 R9.1
  Bottom 0.203: D19.TP 24.5,42 28.5,38 v37.75,38
  other vias: 21.75,42
D22/SDA  (via drill 0.25)  (4 unrouted)
  Top 0.203: U4.14 46.25,29.5 v46.5,29.75 | SDA.TP 34.29,29.21 U1.8 37.79,29.21 v38,29 | LED.3 13.77,40.73 v14,40.5 | v52.5,10.75 52.25,11 U13.1 | U6.2 46.5,4.75 47.25,5.5 v47.75,5.5 | U15.4 v46,12 | U17.3 41.7,22.95 v42,23.25
  Bottom 0.203: SDA.TP 23,40.5 v14,40.5 | v46.5,29.75 46.25,29.5 39.5,29.5 39,29 v38,29 | v46,12 46.25,11.75 51.5,11.75 v52.5,10.75
  other vias: 34.25,29.25
D23/SCL  (via drill 0.25)  (4 unrouted)
  Top 0.203: v38,27 37.67,26.67 U1.7 34.33,26.67 SCL.TP | U4.13 46.25,29 v46.5,28.75 | LED.4 16.31,40.19 v18.5,38 | U13.2 52.25,13 v52.5,13.25 | v48.5,4.5 48,4 U6.1 | U15.2 v47.25,13.5 | U17.6 43.3,18.7 v43.5,18.5
  Bottom 0.203: SCL.TP 33,28 33,29 24,38 v18.5,38 | v46.5,28.75 45.75,28 39.5,28 38.5,27 v38,27 | v47.25,13.5 48.25,12.5 51.75,12.5 v52.5,13.25
  other vias: 34.25,26.75
D24/MISO/MDAT  (via drill 0.25)
  Top 0.203: v32,36.75 31.25,36 31.25,11.75 v35.25,7.75 | U1.11 34.33,36.83 D24.TP | U7.1 41.39,10.07 42.25,9.22 v42.25,8.5
  Bottom 0.203: D24.TP v32,36.75 | v42.25,8.5 41.25,9.5 37,9.5 v35.25,7.75
  other vias: 34.25,36.75
D25/MOSI/PIX  (via drill 0.25)
  Top 0.203: U1.10 34.29,34.29 D25.TP | D2.3 42.02,5.5 v42.5,5.5 | v37,3.5 30.5,10 30.5,35 v30,35.5
  Bottom 0.203: v42.5,5.5 40.5,3.5 v37,3.5 | v30,35.5 31.25,34.25 D25.TP
  other vias: 34.25,34.25
D26/SCLK/MCLK  (via drill 0.25)
  Top 0.203: U1.9 D26.TP 32.75,31.75 31.75,30.75 31.75,12 35.25,8.5 v38.75,8.5 38.75,9.25 39.58,10.07 U7.2
  other vias: 34.25,31.75
GND  (via drill 0.25, 0.35)
  Top 0.203: TC1.5 44.91,36.09 v45,36 | U4.1 44.75,30.75 44.5,31 44.25,31 | U4.3 43.75,30.75 44,31 44.25,31 | 44.25,31 44.5,31.25 v45,31.25 | U4.7 42.25,28.5 42,28.75 | U4.6 42.25,29 42,28.75 | U4.2 44.25,31 | 42,28.75 v41.5,28.75 | U5.3 5.83,6.17 v4.75,7.25 | VR1.1 v17,18 | 38.5,12 39.58,10.93 U7.3 | 38.5,12 v38.5,13.25 | U7.6 v40.5,8.5 | v43,10.5 U7.5 | U7.5 | R8.1 v50.25,41 | U13.4 49.86,11.6 C5.2 | C5.2 49.99,10.75 v50.5,10.75 | U6.6 47.15,1.4 v46.75,1 | U15.9 48.5,12 48.75,11.75 | U15.8 48.5,11.5 48.75,11.75 | C5.2 49.26,11.24 48.75,11.75 | U15.3 46.74,12.76 46.25,13.25 v46.25,13.5 | U15.5 46.74,11.24 46.25,10.75 v46.25,10.5 | U7.8 38.73,11.78 | 38.73,11.78 38.5,12 | U7.7 38.73,11.78 | 38.73,11.78 38.5,12 | v40.5,25.5 41.49,25.5 C21.2 | v40.5,32 40.51,32.01 C20.2 | D2.2 42.27,3 v43.5,3
  Top 0.305: U3.7 14.68,33.42 v15,33.75 | C26.2 v38.5,13.25 | v49.25,32.75 50.49,32.75 C18.1 | v50.5,29.5 C11.1 | v48.5,7 C28.2 | C29.2 v42.5,7 | U5.5 15.46,5.54 v15.75,5.25 | C27.2 v44,16.75 | v40,22.5 C31.2 42.24,21.26 U17.EP | v45,18.5 C30.2 | U17.4 41.7,20.45 42.25,21 U17.EP | U17.2 U17.EP
  GND 0.203: v46.25,13.5 46.25,13.25 47.5,12 | 47.5,12 49.25,12 v50.5,10.75 50.25,10.75 49.5,10 49.5,8 | v46.25,10.5 46.25,10.75 47.5,12
  GND 0.305: 49.5,8 v48.5,7
  other vias: 7.75,12.5 6.75,12.5 21.75,44 34.25,44 21.75,11.5 34.25,11.5 14.25,9.75 5.5,12.5 48,42.75 10,29 17.5,29.5 10,32.5 12.25,23 6.75,42.25 10,19.25 15.75,3.75
  pour GND (isolate 0.406): -0.5,-0.5 -0.5,49 56.5,49 56.5,-0.5
  pour Bottom (isolate 0.406): -0.5,-0.5 -0.5,49 56.5,49 56.5,-0.5
  pour Top (isolate 0.406): -0.5,-0.5 -0.5,49 56.5,49 56.5,-0.5
  pour Top (rank 6, no thermals): 9,13.25 5,13.25 5,11.75 9,11.75
N$1
  Top 0.203: U2.6 6.25,10.85 5.64,10.24 C3.1
N$2
  Top 0.203: U2.7 6.75,10.5 5.5,9.25 3.49,9.25 3,9.74 R3.1 R2.2
N$3
  Top 0.203: R7.1 11,21.1 12.6,19.5 VR1.2
N$4
  Top 0.203: R7.2 C22.2 C12.1
N$5
  Top 0.203: R8.2 R9.2 52.75,39.74 PIR.3
N$8
  Top 0.203: U5.4 7.08,4.42 7.5,4 R6.2
N$9
  Top 0.203: U2.2 7.75,14.25 8,14.5 8.25,14.25 U2.1
  Top 0.406: 8,14.5 8.25,14.75 9.09,14.75 10.25,13.59 L1.2
N$10
  Top 0.203: R4.1 C12.2
N$11
  Top 0.203: R5.1 C13.2
N$12
  Top 0.203: U3.3 15.32,26.8 14.75,26.23 R4.2
N$13
  Top 0.203: U3.4 15.97,27.29 16,27.26 R5.2
N$16
  Top 0.254: C14.2 16.04,32.26 U3.5
  Top 0.305: SPKR.1 16.27,33.75 15.97,33.45 U3.5
N$17
  Top 0.254: C15.2 13.72,32.5 U3.8
  Top 0.305: U3.8 14.03,33.48 13.73,33.77 SPKR.2
PWR_EN  (via drill 0.25)
  Top 0.203: U3.1 11.3,27.8 10,26.5 10,20.75 11,19.75 v11,15.25 | U2.9 v7.75,9.5 | U1.4 35.82,19 PEN.TP
  Bottom 0.203: PEN.TP 33.75,19 30,15.25 v11,15.25 5.25,15.25 3.5,13.5 3.5,11 5,9.5 v7.75,9.5 7.75,2.5 8.5,1.75 PWR-SW.2
  other vias: 34.25,19
SWDCLK  (via drill 0.25)
  Top 0.203: TC1.4 43.65,39.85 v43.5,40 | v37.5,47 35.88,47 U1.15
  Bottom 0.203: v43.5,40 42,41.5 40,41.5 37.5,44 v37.5,47
SWDIO  (via drill 0.25)
  Top 0.203: TC1.2 42.38,39.12 v41.5,40 | U1.16 v18.51,46.99 v18.5,47
  Bottom 0.203: v18.5,47 18.25,46.75 18.25,44.5 19.5,43.25 27.75,43.25 30.5,40.5 41,40.5 v41.5,40
VBAT  (via drill 0.35)
  Top 0.305: U5.6 10.58,6.17 v10.5,6.25
  Top 0.406: VBT.TP 21.66,21.59 U1.26 18.59,21.59 v18.5,21.5 | v9.25,6.25 v10.5,6.25
  PWR 0.406: v9.25,6.25 v10.5,6.25 12.75,6.25 18.25,11.75 18.25,21.25 v18.5,21.5 VBT.TP
  Bottom 0.406: v9.25,6.25 v10.5,6.25 11.7,6.25 BATT.2
  other vias: 21.75,21.5
VBUS  (via drill 0.25, 0.35)
  Top 0.305: U5.8 15.42,7.46 15.46,7.5 v15.5,7.5
  Top 0.406: U1.29 20.16,14 VBS.TP | U1.2 34.28,13.97 v34.25,14
  PWR 0.406: v16.5,7.5 v15.5,7.5
  Bottom 0.406: v15.5,7.5 v16.5,7.5 19,10 19,11.5 21.5,14 VBS.TP v34.25,14
  other vias: 21.75,14
VIN
  Top 0.254: 8.61,10.49 8.25,10.85 U2.10
  Top 0.305: U5.7 11.92,6.83 11.49,7.26 C1.1
  Top 0.406: L1.1 10.25,11.41 9.33,10.49 8.61,10.49 | L1.1 10.75,10.49 C1.1 | C8.1 12.67,11.41 L1.1

### Text on the board
bPlace: G | P | D | C | T | E | P | G | Br | Rd | Yw | I | P | G | G | P | D | C | Br | Rd | Yw | I | O++O / v2A 2021.12 | + | +